# EAGLE design dotstar-stick-mk-1.0 (EAGLE 7.5.0)
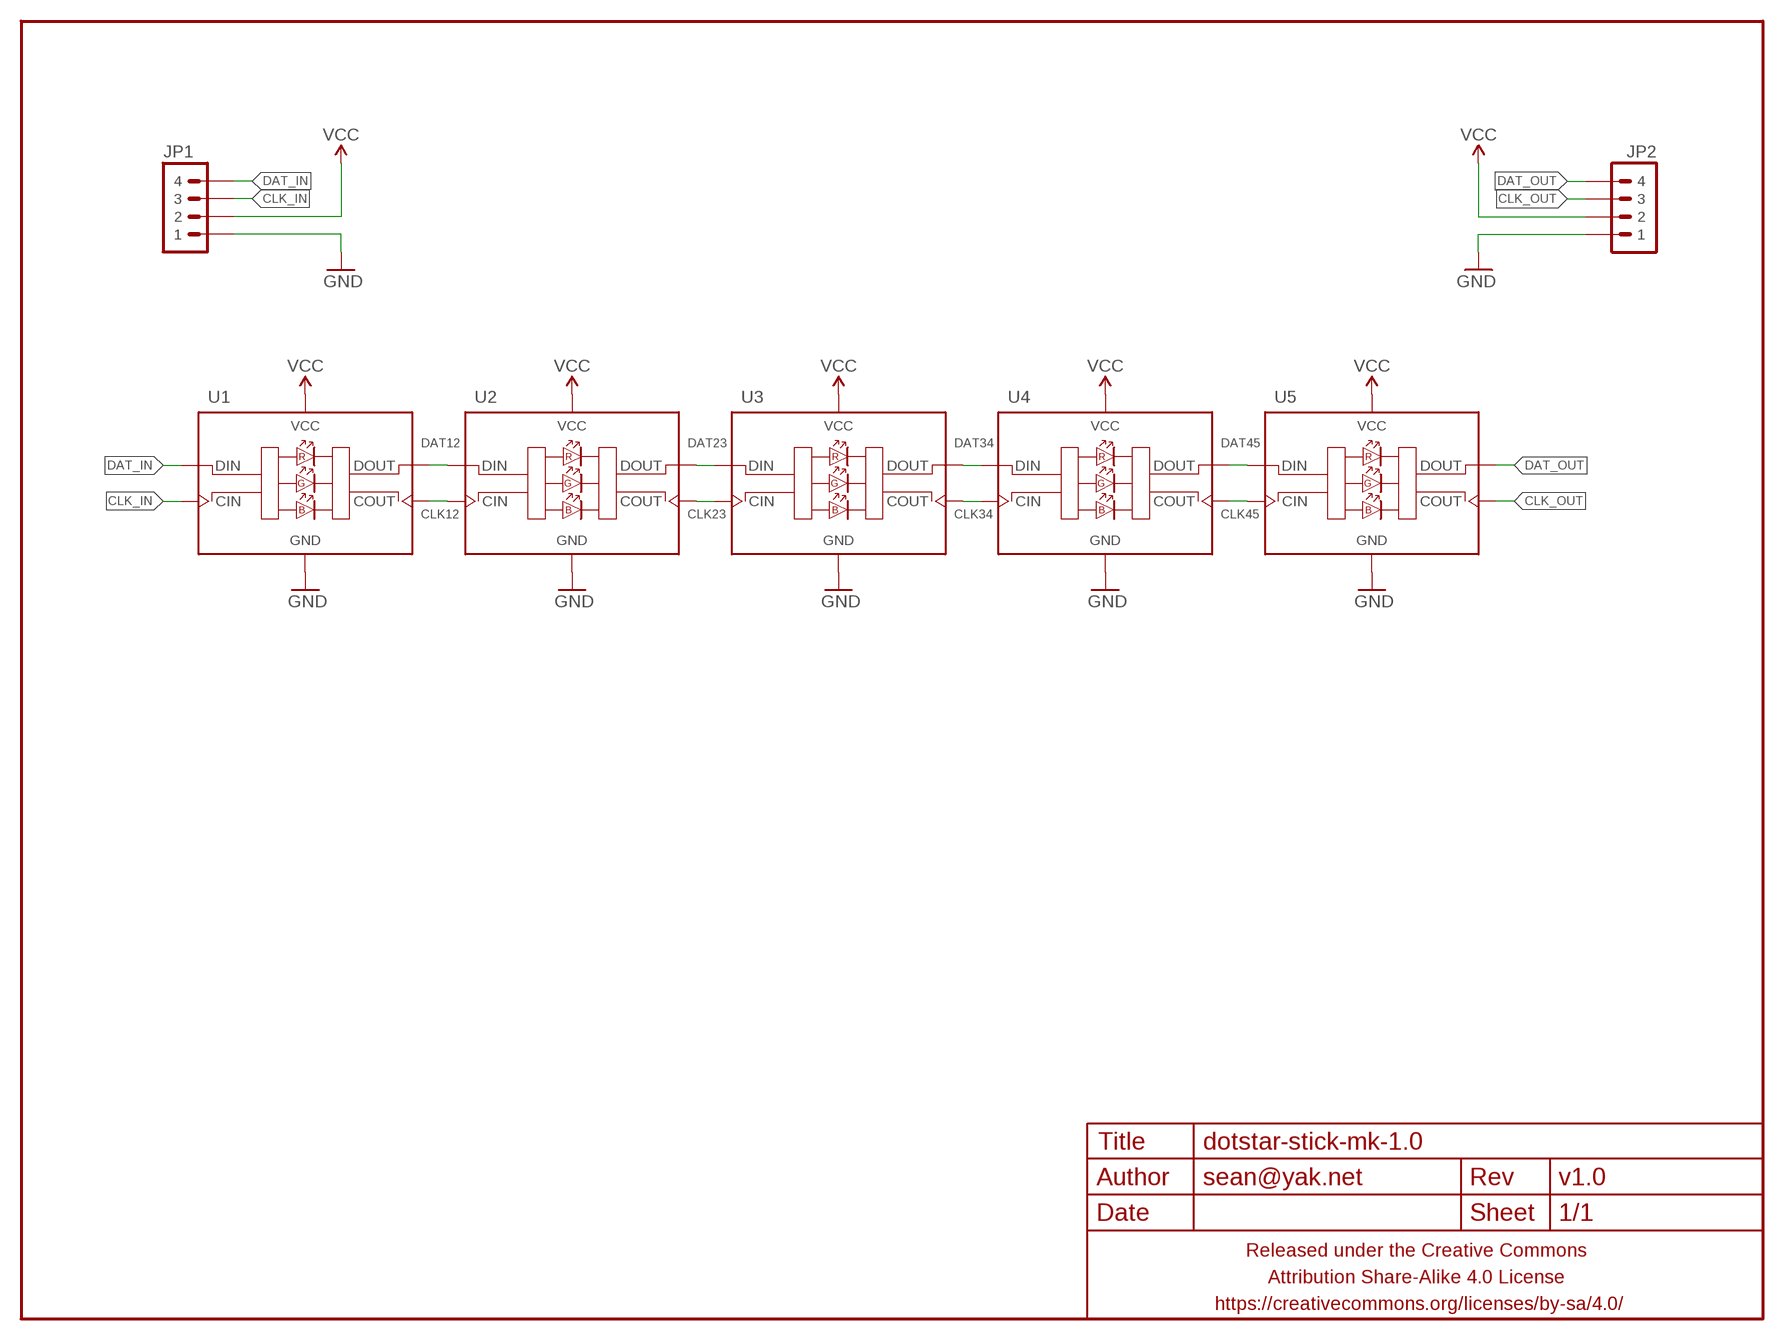
[diagram p0: schematic, sheet 1]

## Parts
FRAME1  FRAME-LETTERNO_PACKAGE  [DUMMY]
JP1  M04PTH-2MM-CENTERED  [1X04-2MM-CENTERED]
JP2  M04PTH-2MM-CENTERED  [1X04-2MM-CENTERED]
U1  DOTSTARAPA102-5050  [LED-5050]
U2  DOTSTARAPA102-5050  [LED-5050]
U3  DOTSTARAPA102-5050  [LED-5050]
U4  DOTSTARAPA102-5050  [LED-5050]
U5  DOTSTARAPA102-5050  [LED-5050]

## Nets
CLK12: U1.5(COUT) U2.2(CIN)
CLK23: U2.5(COUT) U3.2(CIN)
CLK34: U3.5(COUT) U4.2(CIN)
CLK45: U4.5(COUT) U5.2(CIN)
CLK_IN: JP1.3 U1.2(CIN)
CLK_OUT: JP2.3 U5.5(COUT)
DAT12: U1.6(DOUT) U2.1(DIN)
DAT23: U2.6(DOUT) U3.1(DIN)
DAT34: U3.6(DOUT) U4.1(DIN)
DAT45: U4.6(DOUT) U5.1(DIN)
DAT_IN: JP1.4 U1.1(DIN)
DAT_OUT: JP2.4 U5.6(DOUT)
GND: JP1.1 JP2.1 U1.3(GND) U2.3(GND) U3.3(GND) U4.3(GND) U5.3(GND)
VCC: JP1.2 JP2.2 U1.4(VCC) U2.4(VCC) U3.4(VCC) U4.4(VCC) U5.4(VCC)

## Library data of the parts
FRAME1 = a_parts:FRAME-LETTER: Schematic Frame Standard 8.5x11 US Letter frame; DESIGNER: sean@yak.net; VERSION: v1.0
JP1 JP2 = a_parts:M04: Header 4 Standard 4-pin 0.1" header. Use with straight break away headers (SKU : PRT-00116), right angle break away headers (PRT-00553), swiss pins (PRT-00743), machine pins (PRT-00117), and female headers (PRT-00115). Molex polarized connector foot print use with SKU : PRT-08231 with associated crimp pins and housings. 1MM SMD Version SKU: PRT-10208
U1-U5 = a_parts:DOTSTAR

## Board
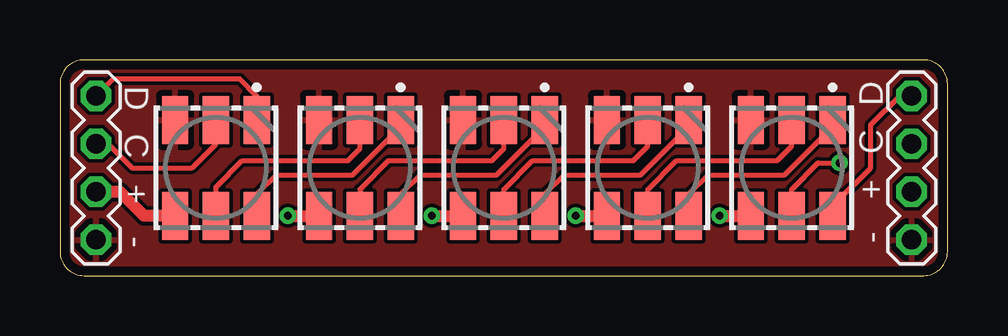
[diagram p1: board, top side]
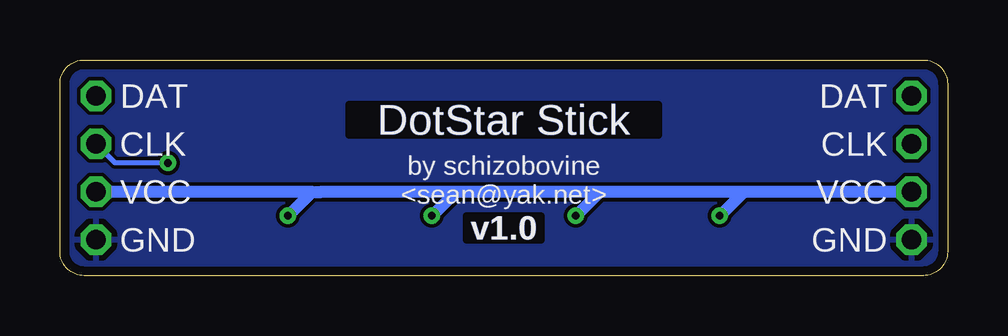
[diagram p2: board, bottom side, seen from below]

Size 37 x 9 mm. Coordinates in mm from the lower left corner, seen from the top.
Outline: 37,1 37,8 arc90 36,9 1,9 arc90 0,8 0,1 arc90 1,0 36,0 arc90 37,1
Copper layers (1*16): Top 0.0356mm / dielectric 1.5011mm / Bottom 0.0356mm
Design rules "LaenPCBOrder_2": minimum track width 6mil, minimum drill 13mil, track to track 6mil, track to pad 6mil, pad to pad 6mil, via to via 6mil, smd to smd 6mil, copper to edge 15mil, drill to drill 6mil, minimum pad ring 7mil, minimum via ring 7mil, stop-mask expansion 3mil, vias tented up to drill 20mil, thermal gap 10mil

### Footprints (pad centres in the part's own frame; a part is rotated, then mirrored left to right if it is on the bottom)
1X04-2MM-CENTERED = drill 0.8 pad 1.27 octagon: 1 -3,0; 2 -1,0; 3 1,0; 4 3,0
LED-5050 = smd 2 x 1.1: 1 -2,1.7; 2 -2,0; 3 -2,-1.7; 4 2,-1.7; 5 2,0; 6 2,1.7

### Placement (x,y rotation side)
FRAME1  0,0 0 top
JP1  1.5,4.5 90 top
JP2  35.5,4.5 90 top
U1  6.5,4.5 270 top
U2  12.5,4.5 270 top
U3  18.5,4.5 270 top
U4  24.5,4.5 270 top
U5  30.5,4.5 270 top

### Tracks (layer width: path | path; a pad name or v marks a point on that pad's centre or on a via)
CLK12
  Top 0.2: U2.2 12.5,5.3 12,4.8 7.6,4.8 6.5,3.7 U1.5
CLK23
  Top 0.2: U3.2 18.5,5.3 18,4.8 13.7,4.8 12.5,3.6 U2.5
CLK34
  Top 0.2: U4.2 24.5,5.4 23.9,4.8 19.7,4.8 18.5,3.6 U3.5
CLK45
  Top 0.2: U5.2 30.5,5.4 29.9,4.8 25.7,4.8 24.5,3.6 U4.5
CLK_IN
  Top 0.2: JP1.3 2,5.5 3,4.5 5.5,4.5 6.5,5.5 U1.2
CLK_OUT  (via drill 0.33)
  Top 0.2: U5.5 30.5,3.6 31.6,4.7 v32.5,4.7
  Bottom 0.2: v32.5,4.7 34.7,4.7 JP2.3
DAT12
  Top 0.2: U2.1 14.2,6.2 12.2,4.2 9,4.2 8.2,3.4 U1.6
DAT23
  Top 0.2: U3.1 20.2,6.2 18.2,4.2 15,4.2 14.2,3.4 U2.6
DAT34
  Top 0.2: U4.1 26.2,6.2 24.2,4.2 21,4.2 20.2,3.4 U3.6
DAT45
  Top 0.2: U5.1 32.2,6.2 30.2,4.2 27,4.2 26.2,3.4 U4.6
DAT_IN
  Top 0.2: JP1.4 2.2,8.2 7.5,8.2 8.2,7.5 U1.1
DAT_OUT
  Top 0.2: U5.6 32.2,2.9 33.8,4.5 33.8,6.3 35,7.5 JP2.4
GND
  pour Bottom: 1,9 36,9 arc-90 37,8 37,1 arc-90 36,0 1,0 arc-90 0,1 0,8 arc-90
  pour Top: 1,9 36,9 arc-90 37,8 37,1 arc-90 36,0 1,0 arc-90 0,1 0,8 arc-90
VCC  (via drill 0.33)
  Top 0.508: v9.5,2.5 U2.4 | v15.5,2.5 U3.4 | v21.5,2.5 U4.4 | v27.5,2.5 U5.4 | U1.4 3.5,2.5 2.5,3.5 JP1.2
  Bottom 0.508: JP1.2 8.5,3.5 | 8.5,3.5 14.5,3.5 | 14.5,3.5 20.5,3.5 | 20.5,3.5 26.1,3.5 26.5,3.5 | 26.5,3.5 JP2.2 | v9.5,2.5 8.5,3.5 | v15.5,2.5 14.5,3.5 | v21.5,2.5 20.5,3.5 | v27.5,2.5 26.5,3.5

### Text on the board
Bottom: DotStar Stick
tPlace: D | D | C | C | + | + | - | -
bPlace: DAT | DAT | CLK | DotStar Stick | CLK | VCC | by schizobovine / <sean@yak.net> | VCC | GND | GND